# Altium project STM32F427IIH6.PrjPcb
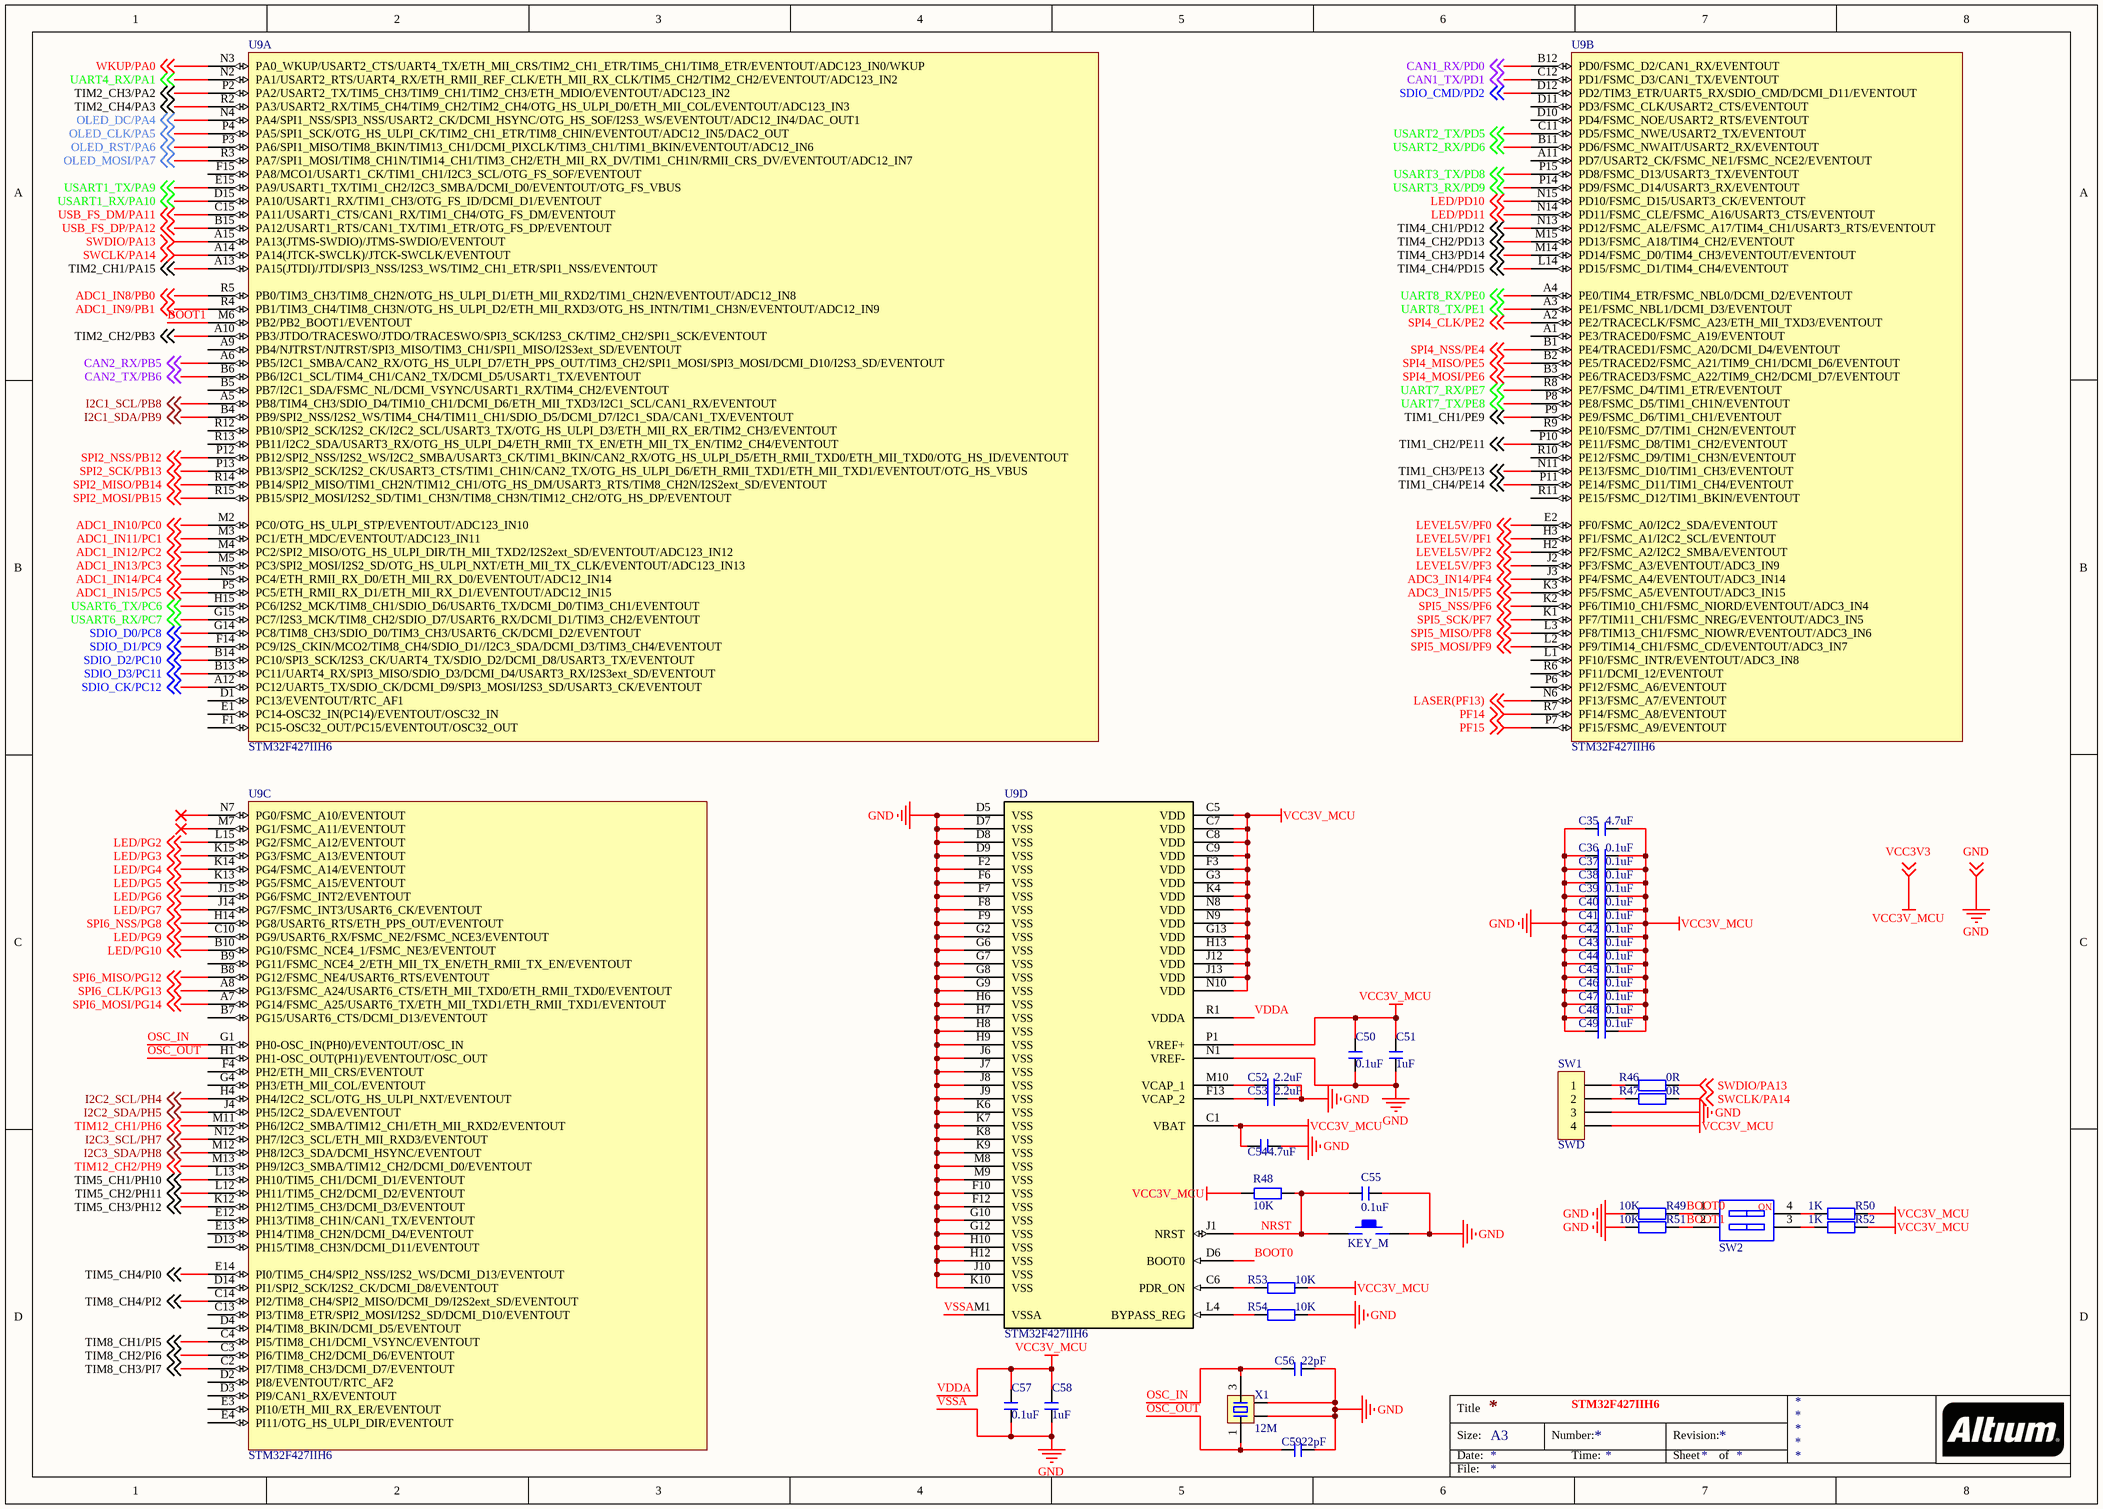
[diagram p0: STM32Core.SchDoc]
2 sheets, 130 parts. Net scope: global (net labels, ports and power ports of the same name join across sheets).
Board file: STM32F427IIH6.PcbDoc
Sheets:
  STM32Core.SchDoc
  Peripheral.SchDoc

## Sheet STM32Core.SchDoc
size A3

### Parts
C35  4.7uF  [C 0402_L]
C36  0.1uF  [C 0402_L]
C37  0.1uF  [C 0402_L]
C38  0.1uF  [C 0402_L]
C39  0.1uF  [C 0402_L]
C40  0.1uF  [C 0402_L]
C41  0.1uF  [C 0402_L]
C42  0.1uF  [C 0402_L]
C43  0.1uF  [C 0402_L]
C44  0.1uF  [C 0402_L]
C45  0.1uF  [C 0402_L]
C46  0.1uF  [C 0402_L]
C47  0.1uF  [C 0402_L]
C48  0.1uF  [C 0402_L]
C49  0.1uF  [C 0402_L]
C50  0.1uF  [C 0402_L]
C51  1uF  [C 0402_L]
C52  2.2uF  [C 0402_L]
C53  2.2uF  [C 0402_L]
C54  4.7uF  [C 0402_L]
C55  0.1uF  [C 0402_L]
C56  22pF  [C 0402_L]
C57  0.1uF  [C 0402_L]
C58  1uF  [C 0402_L]
C59  22pF  [C 0402_L]
R46  0R  [R 0402_L]
R47  0R  [R 0402_L]
R48  10K  [R 0402_L]
R49  10K  [R 0402_L]
R50  1K  [R 0402_L]
R51  10K  [R 0402_L]
R52  1K  [R 0402_L]
R53  10K  [R 0402_L]
R54  10K  [R 0402_L]
RST2  KEY_M  [SMD-3.2*4.2]
SW1  SWD  [MX 1.25-WS-4P]
SW2  SW-2P  [CSW1.27 SMD-2P]  (value not drawn)
U9  STM32F427IIH6  [BGA 176]  (parts A,B,C,D of 4)
X1  12M  [OSC 3225-4P]

### Nets
VDDA: C35.2 C36.2 C37.2 C38.2 C39.2 C40.2 C41.2 C42.2 C43.2 C44.2 C45.2 C46.2 C47.2 C48.2 C49.2 C50.2 C51.2 C54.2 C57.2 C58.2 R48.2 R50.2 R52.2 R53.1 SW1.4 U9.C1(VBAT) U9.C5(VDD) U9.C7(VDD) U9.C8(VDD) U9.C9(VDD) U9.F3(VDD) U9.G3(VDD) U9.G13(VDD) U9.H13(VDD) U9.J12(VDD) U9.J13(VDD) U9.K4(VDD) U9.N8(VDD) U9.N9(VDD) U9.N10(VDD) U9.P1(VREF+) U9.R1(VDDA) ; off-sheet VCC3V3  [also labelled VCC3V3, VCC3V_MCU]
VSSA: C35.1 C36.1 C37.1 C38.1 C39.1 C40.1 C41.1 C42.1 C43.1 C44.1 C45.1 C46.1 C47.1 C48.1 C49.1 C50.1 C51.1 C52.2 C53.2 C54.1 C55.2 C56.2 C57.1 C58.1 C59.2 R49.1 R51.1 R54.1 RST2.2 SW1.3 U9.D5(VSS) U9.D7(VSS) U9.D8(VSS) U9.D9(VSS) U9.F2(VSS) U9.F6(VSS) U9.F7(VSS) U9.F8(VSS) U9.F9(VSS) U9.F10(VSS) U9.F12(VSS) U9.G2(VSS) U9.G6(VSS) U9.G7(VSS) U9.G8(VSS) U9.G9(VSS) U9.G10(VSS) U9.G12(VSS) U9.H6(VSS) U9.H7(VSS) U9.H8(VSS) U9.H9(VSS) U9.H10(VSS) U9.H12(VSS) U9.J6(VSS) U9.J7(VSS) U9.J8(VSS) U9.J9(VSS) U9.J10(VSS) U9.K6(VSS) U9.K7(VSS) U9.K8(VSS) U9.K9(VSS) U9.K10(VSS) U9.M1(VSSA) U9.M8(VSS) U9.M9(VSS) U9.N1(VREF-) X1.2 X1.4 ; off-sheet GND  [also labelled GND]
ADC1_IN8/PB0: U9.R5(PB0/TIM3_CH3/TIM8_CH2N/OTG_HS_ULPI_D1/ETH_MII_RXD2/TIM1_CH2N/EVENTOUT/ADC12_IN8) ; off-sheet ADC1_IN8/PB0
ADC1_IN9/PB1: U9.R4(PB1/TIM3_CH4/TIM8_CH3N/OTG_HS_ULPI_D2/ETH_MII_RXD3/OTG_HS_INTN/TIM1_CH3N/EVENTOUT/ADC12_IN9) ; off-sheet ADC1_IN9/PB1
ADC1_IN10/PC0: U9.M2(PC0/OTG_HS_ULPI_STP/EVENTOUT/ADC123_IN10) ; off-sheet ADC1_IN10/PC0
ADC1_IN11/PC1: U9.M3(PC1/ETH_MDC/EVENTOUT/ADC123_IN11) ; off-sheet ADC1_IN11/PC1
ADC1_IN12/PC2: U9.M4(PC2/SPI2_MISO/OTG_HS_ULPI_DIR/TH_MII_TXD2/I2S2ext_SD/EVENTOUT/ADC123_IN12) ; off-sheet ADC1_IN12/PC2
ADC1_IN13/PC3: U9.M5(PC3/SPI2_MOSI/I2S2_SD/OTG_HS_ULPI_NXT/ETH_MII_TX_CLK/EVENTOUT/ADC123_IN13) ; off-sheet ADC1_IN13/PC3
ADC1_IN14/PC4: U9.N5(PC4/ETH_RMII_RX_D0/ETH_MII_RX_D0/EVENTOUT/ADC12_IN14) ; off-sheet ADC1_IN14/PC4
ADC1_IN15/PC5: U9.P5(PC5/ETH_RMII_RX_D1/ETH_MII_RX_D1/EVENTOUT/ADC12_IN15) ; off-sheet ADC1_IN15/PC5
ADC3_IN14/PF4: U9.J3(PF4/FSMC_A4/EVENTOUT/ADC3_IN14) ; off-sheet ADC3_IN14/PF4
ADC3_IN15/PF5: U9.K3(PF5/FSMC_A5/EVENTOUT/ADC3_IN15) ; off-sheet ADC3_IN15/PF5
BOOT0: R49.2 SW2.1 U9.D6(BOOT0)
BOOT1: R51.2 SW2.2 U9.M6(PB2/PB2_BOOT1/EVENTOUT)
CAN1_RX/PD0: U9.B12(PD0/FSMC_D2/CAN1_RX/EVENTOUT) ; off-sheet CAN1_RX/PD0
CAN1_TX/PD1: U9.C12(PD1/FSMC_D3/CAN1_TX/EVENTOUT) ; off-sheet CAN1_TX/PD1
CAN2_RX/PB5: U9.A6(PB5/I2C1_SMBA/CAN2_RX/OTG_HS_ULPI_D7/ETH_PPS_OUT/TIM3_CH2/SPI1_MOSI/SPI3_MOSI/DCMI_D10/I2S3_SD/EVENTOUT) ; off-sheet CAN2_RX/PB5
CAN2_TX/PB6: U9.B6(PB6/I2C1_SCL/TIM4_CH1/CAN2_TX/DCMI_D5/USART1_TX/EVENTOUT) ; off-sheet CAN2_TX/PB6
I2C1_SCL/PB8: U9.A5(PB8/TIM4_CH3/SDIO_D4/TIM10_CH1/DCMI_D6/ETH_MII_TXD3/I2C1_SCL/CAN1_RX/EVENTOUT) ; off-sheet I2C1_SCL/PB8
I2C1_SDA/PB9: U9.B4(PB9/SPI2_NSS/I2S2_WS/TIM4_CH4/TIM11_CH1/SDIO_D5/DCMI_D7/I2C1_SDA/CAN1_TX/EVENTOUT) ; off-sheet I2C1_SDA/PB9
I2C2_SCL/PH4: U9.H4(PH4/I2C2_SCL/OTG_HS_ULPI_NXT/EVENTOUT) ; off-sheet I2C2_SCL/PH4
I2C2_SDA/PH5: U9.J4(PH5/I2C2_SDA/EVENTOUT) ; off-sheet I2C2_SDA/PH5
I2C3_SCL/PH7: U9.N12(PH7/I2C3_SCL/ETH_MII_RXD3/EVENTOUT) ; off-sheet I2C3_SCL/PH7
I2C3_SDA/PH8: U9.M12(PH8/I2C3_SDA/DCMI_HSYNC/EVENTOUT) ; off-sheet I2C3_SDA/PH8
LASER(PF13): U9.N6(PF13/FSMC_A7/EVENTOUT) ; off-sheet LASER(PF13)
LED/PD10: U9.N15(PD10/FSMC_D15/USART3_CK/EVENTOUT) ; off-sheet LED/PD10
LED/PD11: U9.N14(PD11/FSMC_CLE/FSMC_A16/USART3_CTS/EVENTOUT) ; off-sheet LED/PD11
LED/PG2: U9.L15(PG2/FSMC_A12/EVENTOUT) ; off-sheet LED/PG2
LED/PG3: U9.K15(PG3/FSMC_A13/EVENTOUT) ; off-sheet LED/PG3
LED/PG4: U9.K14(PG4/FSMC_A14/EVENTOUT) ; off-sheet LED/PG4
LED/PG5: U9.K13(PG5/FSMC_A15/EVENTOUT) ; off-sheet LED/PG5
LED/PG6: U9.J15(PG6/FSMC_INT2/EVENTOUT) ; off-sheet LED/PG6
LED/PG7: U9.J14(PG7/FSMC_INT3/USART6_CK/EVENTOUT) ; off-sheet LED/PG7
LED/PG9: U9.C10(PG9/USART6_RX/FSMC_NE2/FSMC_NCE3/EVENTOUT) ; off-sheet LED/PG9
LED/PG10: U9.B10(PG10/FSMC_NCE4_1/FSMC_NE3/EVENTOUT) ; off-sheet LED/PG10
LEVEL5V/PF0: U9.E2(PF0/FSMC_A0/I2C2_SDA/EVENTOUT) ; off-sheet LEVEL5V/PF0
LEVEL5V/PF1: U9.H3(PF1/FSMC_A1/I2C2_SCL/EVENTOUT) ; off-sheet LEVEL5V/PF1
LEVEL5V/PF2: U9.H2(PF2/FSMC_A2/I2C2_SMBA/EVENTOUT) ; off-sheet LEVEL5V/PF2
LEVEL5V/PF3: U9.J2(PF3/FSMC_A3/EVENTOUT/ADC3_IN9) ; off-sheet LEVEL5V/PF3
NRST: C55.1 R48.1 RST2.1 U9.J1(NRST)
OLED_CLK/PA5: U9.P4(PA5/SPI1_SCK/OTG_HS_ULPI_CK/TIM2_CH1_ETR/TIM8_CHIN/EVENTOUT/ADC12_IN5/DAC2_OUT) ; off-sheet OLED_CLK/PA5
OLED_DC/PA4: U9.N4(PA4/SPI1_NSS/SPI3_NSS/USART2_CK/DCMI_HSYNC/OTG_HS_SOF/I2S3_WS/EVENTOUT/ADC12_IN4/DAC_OUT1) ; off-sheet OLED_DC/PA4
OLED_MOSI/PA7: U9.R3(PA7/SPI1_MOSI/TIM8_CH1N/TIM14_CH1/TIM3_CH2/ETH_MII_RX_DV/TIM1_CH1N/RMII_CRS_DV/EVENTOUT/ADC12_IN7) ; off-sheet OLED_MOSI/PA7
OLED_RST/PA6: U9.P3(PA6/SPI1_MISO/TIM8_BKIN/TIM13_CH1/DCMI_PIXCLK/TIM3_CH1/TIM1_BKIN/EVENTOUT/ADC12_IN6) ; off-sheet OLED_RST/PA6
OSC_IN: C56.1 U9.G1(PH0-OSC_IN(PH0)/EVENTOUT/OSC_IN) X1.3
OSC_OUT: C59.1 U9.H1(PH1-OSC_OUT(PH1)/EVENTOUT/OSC_OUT) X1.1
PF14: U9.R7(PF14/FSMC_A8/EVENTOUT) ; off-sheet PF14
PF15: U9.P7(PF15/FSMC_A9/EVENTOUT) ; off-sheet PF15
SDIO_CK/PC12: U9.A12(PC12/UART5_TX/SDIO_CK/DCMI_D9/SPI3_MOSI/I2S3_SD/USART3_CK/EVENTOUT) ; off-sheet SDIO_CK/PC12  [project net SDIO_CLK(PC12)]
SDIO_CMD/PD2: U9.D12(PD2/TIM3_ETR/UART5_RX/SDIO_CMD/DCMI_D11/EVENTOUT) ; off-sheet SDIO_CMD/PD2  [project net SDIO_CMD(PD2)]
SDIO_D0/PC8: U9.G14(PC8/TIM8_CH3/SDIO_D0/TIM3_CH3/USART6_CK/DCMI_D2/EVENTOUT) ; off-sheet SDIO_D0/PC8  [project net SDIO_D0(PC8)]
SDIO_D1/PC9: U9.F14(PC9/I2S_CKIN/MCO2/TIM8_CH4/SDIO_D1//I2C3_SDA/DCMI_D3/TIM3_CH4/EVENTOUT) ; off-sheet SDIO_D1/PC9  [project net SDIO_D1(PC9)]
SDIO_D2/PC10: U9.B14(PC10/SPI3_SCK/I2S3_CK/UART4_TX/SDIO_D2/DCMI_D8/USART3_TX/EVENTOUT) ; off-sheet SDIO_D2/PC10  [project net SDIO_D2(PC10)]
SDIO_D3/PC11: U9.B13(PC11/UART4_RX/SPI3_MISO/SDIO_D3/DCMI_D4/USART3_RX/I2S3ext_SD/EVENTOUT) ; off-sheet SDIO_D3/PC11  [project net SDIO_D3(PC11)]
SPI2_MISO/PB14: U9.R14(PB14/SPI2_MISO/TIM1_CH2N/TIM12_CH1/OTG_HS_DM/USART3_RTS/TIM8_CH2N/I2S2ext_SD/EVENTOUT) ; off-sheet SPI2_MISO/PB14
SPI2_MOSI/PB15: U9.R15(PB15/SPI2_MOSI/I2S2_SD/TIM1_CH3N/TIM8_CH3N/TIM12_CH2/OTG_HS_DP/EVENTOUT) ; off-sheet SPI2_MOSI/PB15
SPI2_NSS/PB12: U9.P12(PB12/SPI2_NSS/I2S2_WS/I2C2_SMBA/USART3_CK/TIM1_BKIN/CAN2_RX/OTG_HS_ULPI_D5/ETH_RMII_TXD0/ETH_MII_TXD0/OTG_HS_ID/EVENTOUT) ; off-sheet SPI2_NSS/PB12
SPI2_SCK/PB13: U9.P13(PB13/SPI2_SCK/I2S2_CK/USART3_CTS/TIM1_CH1N/CAN2_TX/OTG_HS_ULPI_D6/ETH_RMII_TXD1/ETH_MII_TXD1/EVENTOUT/OTG_HS_VBUS) ; off-sheet SPI2_SCK/PB13
SPI4_CLK/PE2: U9.A2(PE2/TRACECLK/FSMC_A23/ETH_MII_TXD3/EVENTOUT) ; off-sheet SPI4_CLK/PE2
SPI4_MISO/PE5: U9.B2(PE5/TRACED2/FSMC_A21/TIM9_CH1/DCMI_D6/EVENTOUT) ; off-sheet SPI4_MISO/PE5
SPI4_MOSI/PE6: U9.B3(PE6/TRACED3/FSMC_A22/TIM9_CH2/DCMI_D7/EVENTOUT) ; off-sheet SPI4_MOSI/PE6
SPI4_NSS/PE4: U9.B1(PE4/TRACED1/FSMC_A20/DCMI_D4/EVENTOUT) ; off-sheet SPI4_NSS/PE4
SPI5_MISO/PF8: U9.L3(PF8/TIM13_CH1/FSMC_NIOWR/EVENTOUT/ADC3_IN6) ; off-sheet SPI5_MISO/PF8
SPI5_MOSI/PF9: U9.L2(PF9/TIM14_CH1/FSMC_CD/EVENTOUT/ADC3_IN7) ; off-sheet SPI5_MOSI/PF9
SPI5_NSS/PF6: U9.K2(PF6/TIM10_CH1/FSMC_NIORD/EVENTOUT/ADC3_IN4) ; off-sheet SPI5_NSS/PF6
SPI5_SCK/PF7: U9.K1(PF7/TIM11_CH1/FSMC_NREG/EVENTOUT/ADC3_IN5) ; off-sheet SPI5_SCK/PF7
SPI6_CLK/PG13: U9.A8(PG13/FSMC_A24/USART6_CTS/ETH_MII_TXD0/ETH_RMII_TXD0/EVENTOUT) ; off-sheet SPI6_CLK/PG13
SPI6_MISO/PG12: U9.B8(PG12/FSMC_NE4/USART6_RTS/EVENTOUT) ; off-sheet SPI6_MISO/PG12
SPI6_MOSI/PG14: U9.A7(PG14/FSMC_A25/USART6_TX/ETH_MII_TXD1/ETH_RMII_TXD1/EVENTOUT) ; off-sheet SPI6_MOSI/PG14
SPI6_NSS/PG8: U9.H14(PG8/USART6_RTS/ETH_PPS_OUT/EVENTOUT) ; off-sheet SPI6_NSS/PG8
SWCLK/PA14: R47.2 U9.A14(PA14(JTCK-SWCLK)/JTCK-SWCLK/EVENTOUT) ; off-sheet SWCLK/PA14
SWDIO/PA13: R46.2 U9.A15(PA13(JTMS-SWDIO)/JTMS-SWDIO/EVENTOUT) ; off-sheet SWDIO/PA13
TIM1_CH1/PE9: U9.P9(PE9/FSMC_D6/TIM1_CH1/EVENTOUT) ; off-sheet TIM1_CH1/PE9
TIM1_CH2/PE11: U9.P10(PE11/FSMC_D8/TIM1_CH2/EVENTOUT) ; off-sheet TIM1_CH2/PE11
TIM1_CH3/PE13: U9.N11(PE13/FSMC_D10/TIM1_CH3/EVENTOUT) ; off-sheet TIM1_CH3/PE13
TIM1_CH4/PE14: U9.P11(PE14/FSMC_D11/TIM1_CH4/EVENTOUT) ; off-sheet TIM1_CH4/PE14
TIM2_CH1/PA15: U9.A13(PA15(JTDI)/JTDI/SPI3_NSS/I2S3_WS/TIM2_CH1_ETR/SPI1_NSS/EVENTOUT) ; off-sheet TIM2_CH1/PA15
TIM2_CH2/PB3: U9.A10(PB3/JTDO/TRACESWO/JTDO/TRACESWO/SPI3_SCK/I2S3_CK/TIM2_CH2/SPI1_SCK/EVENTOUT) ; off-sheet TIM2_CH2/PB3
TIM2_CH3/PA2: U9.P2(PA2/USART2_TX/TIM5_CH3/TIM9_CH1/TIM2_CH3/ETH_MDIO/EVENTOUT/ADC123_IN2) ; off-sheet TIM2_CH3/PA2
TIM2_CH4/PA3: U9.R2(PA3/USART2_RX/TIM5_CH4/TIM9_CH2/TIM2_CH4/OTG_HS_ULPI_D0/ETH_MII_COL/EVENTOUT/ADC123_IN3) ; off-sheet TIM2_CH4/PA3
TIM4_CH1/PD12: U9.N13(PD12/FSMC_ALE/FSMC_A17/TIM4_CH1/USART3_RTS/EVENTOUT) ; off-sheet TIM4_CH1/PD12
TIM4_CH2/PD13: U9.M15(PD13/FSMC_A18/TIM4_CH2/EVENTOUT) ; off-sheet TIM4_CH2/PD13
TIM4_CH3/PD14: U9.M14(PD14/FSMC_D0/TIM4_CH3/EVENTOUT/EVENTOUT) ; off-sheet TIM4_CH3/PD14
TIM4_CH4/PD15: U9.L14(PD15/FSMC_D1/TIM4_CH4/EVENTOUT) ; off-sheet TIM4_CH4/PD15
TIM5_CH1/PH10: U9.L13(PH10/TIM5_CH1/DCMI_D1/EVENTOUT) ; off-sheet TIM5_CH1/PH10
TIM5_CH2/PH11: U9.L12(PH11/TIM5_CH2/DCMI_D2/EVENTOUT) ; off-sheet TIM5_CH2/PH11
TIM5_CH3/PH12: U9.K12(PH12/TIM5_CH3/DCMI_D3/EVENTOUT) ; off-sheet TIM5_CH3/PH12
TIM5_CH4/PI0: U9.E14(PI0/TIM5_CH4/SPI2_NSS/I2S2_WS/DCMI_D13/EVENTOUT) ; off-sheet TIM5_CH4/PI0
TIM8_CH1/PI5: U9.C4(PI5/TIM8_CH1/DCMI_VSYNC/EVENTOUT) ; off-sheet TIM8_CH1/PI5
TIM8_CH2/PI6: U9.C3(PI6/TIM8_CH2/DCMI_D6/EVENTOUT) ; off-sheet TIM8_CH2/PI6
TIM8_CH3/PI7: U9.C2(PI7/TIM8_CH3/DCMI_D7/EVENTOUT) ; off-sheet TIM8_CH3/PI7
TIM8_CH4/PI2: U9.C14(PI2/TIM8_CH4/SPI2_MISO/DCMI_D9/I2S2ext_SD/EVENTOUT) ; off-sheet TIM8_CH4/PI2
TIM12_CH1/PH6: U9.M11(PH6/I2C2_SMBA/TIM12_CH1/ETH_MII_RXD2/EVENTOUT) ; off-sheet TIM12_CH1/PH6
TIM12_CH2/PH9: U9.M13(PH9/I2C3_SMBA/TIM12_CH2/DCMI_D0/EVENTOUT) ; off-sheet TIM12_CH2/PH9
UART4_RX/PA1: U9.N2(PA1/USART2_RTS/UART4_RX/ETH_RMII_REF_CLK/ETH_MII_RX_CLK/TIM5_CH2/TIM2_CH2/EVENTOUT/ADC123_IN2) ; off-sheet UART4_RX/PA1
UART7_RX/PE7: U9.R8(PE7/FSMC_D4/TIM1_ETR/EVENTOUT) ; off-sheet UART7_RX/PE7
UART7_TX/PE8: U9.P8(PE8/FSMC_D5/TIM1_CH1N/EVENTOUT) ; off-sheet UART7_TX/PE8
UART8_RX/PE0: U9.A4(PE0/TIM4_ETR/FSMC_NBL0/DCMI_D2/EVENTOUT) ; off-sheet UART8_RX/PE0
UART8_TX/PE1: U9.A3(PE1/FSMC_NBL1/DCMI_D3/EVENTOUT) ; off-sheet UART8_TX/PE1
USART1_RX/PA10: U9.D15(PA10/USART1_RX/TIM1_CH3/OTG_FS_ID/DCMI_D1/EVENTOUT) ; off-sheet USART1_RX/PA10
USART1_TX/PA9: U9.E15(PA9/USART1_TX/TIM1_CH2/I2C3_SMBA/DCMI_D0/EVENTOUT/OTG_FS_VBUS) ; off-sheet USART1_TX/PA9
USART2_RX/PD6: U9.B11(PD6/FSMC_NWAIT/USART2_RX/EVENTOUT) ; off-sheet USART2_RX/PD6
USART2_TX/PD5: U9.C11(PD5/FSMC_NWE/USART2_TX/EVENTOUT) ; off-sheet USART2_TX/PD5
USART3_RX/PD9: U9.P14(PD9/FSMC_D14/USART3_RX/EVENTOUT) ; off-sheet USART3_RX/PD9
USART3_TX/PD8: U9.P15(PD8/FSMC_D13/USART3_TX/EVENTOUT) ; off-sheet USART3_TX/PD8
USART6_RX/PC7: U9.G15(PC7/I2S3_MCK/TIM8_CH2/SDIO_D7/USART6_RX/DCMI_D1/TIM3_CH2/EVENTOUT) ; off-sheet USART6_RX/PC7
USART6_TX/PC6: U9.H15(PC6/I2S2_MCK/TIM8_CH1/SDIO_D6/USART6_TX/DCMI_D0/TIM3_CH1/EVENTOUT) ; off-sheet USART6_TX/PC6
USB_FS_DM/PA11: U9.C15(PA11/USART1_CTS/CAN1_RX/TIM1_CH4/OTG_FS_DM/EVENTOUT) ; off-sheet USB_FS_DM/PA11
USB_FS_DP/PA12: U9.B15(PA12/USART1_RTS/CAN1_TX/TIM1_ETR/OTG_FS_DP/EVENTOUT) ; off-sheet USB_FS_DP/PA12
WKUP/PA0: U9.N3(PA0_WKUP/USART2_CTS/UART4_TX/ETH_MII_CRS/TIM2_CH1_ETR/TIM5_CH1/TIM8_ETR/EVENTOUT/ADC123_IN0/WKUP) ; off-sheet WKUP/PA0
NetC52_1: C52.1 U9.M10(VCAP_1)
NetC53_1: C53.1 U9.F13(VCAP_2)
NetR46_1: R46.1 SW1.1
NetR47_1: R47.1 SW1.2
NetR50_1: R50.1 SW2.4
NetR52_1: R52.1 SW2.3
NetR53_2: R53.2 U9.C6(PDR_ON)
NetR54_2: R54.2 U9.L4(BYPASS_REG)

Not connected (* = marked no-connect by the designer): U9 A1(PE3/TRACED0/FSMC_A19/EVENTOUT) A9(PB4/NJTRST/NJTRST/SPI3_MISO/TIM3_CH1/SPI1_MISO/I2S3ext_SD/EVENTOUT) A11(PD7/USART2_CK/FSMC_NE1/FSMC_NCE2/EVENTOUT) B5(PB7/I2C1_SDA/FSMC_NL/DCMI_VSYNC/USART1_RX/TIM4_CH2/EVENTOUT) B7(PG15/USART6_CTS/DCMI_D13/EVENTOUT) B9(PG11/FSMC_NCE4_2/ETH_MII_TX_EN/ETH_RMII_TX_EN/EVENTOUT) C13(PI3/TIM8_ETR/SPI2_MOSI/I2S2_SD/DCMI_D10/EVENTOUT) D1(PC13/EVENTOUT/RTC_AF1) D2(PI8/EVENTOUT/RTC_AF2) D3(PI9/CAN1_RX/EVENTOUT) D4(PI4/TIM8_BKIN/DCMI_D5/EVENTOUT) D10(PD4/FSMC_NOE/USART2_RTS/EVENTOUT) D11(PD3/FSMC_CLK/USART2_CTS/EVENTOUT) D13(PH15/TIM8_CH3N/DCMI_D11/EVENTOUT) D14(PI1/SPI2_SCK/I2S2_CK/DCMI_D8/EVENTOUT) E1(PC14-OSC32_IN(PC14)/EVENTOUT/OSC32_IN) E3(PI10/ETH_MII_RX_ER/EVENTOUT) E4(PI11/OTG_HS_ULPI_DIR/EVENTOUT) E12(PH13/TIM8_CH1N/CAN1_TX/EVENTOUT) E13(PH14/TIM8_CH2N/DCMI_D4/EVENTOUT) F1(PC15-OSC32_OUT/PC15/EVENTOUT/OSC32_OUT) F4(PH2/ETH_MII_CRS/EVENTOUT) F15(PA8/MCO1/USART1_CK/TIM1_CH1/I2C3_SCL/OTG_FS_SOF/EVENTOUT) G4(PH3/ETH_MII_COL/EVENTOUT) L1(PF10/FSMC_INTR/EVENTOUT/ADC3_IN8) M7(PG1/FSMC_A11/EVENTOUT)* N7(PG0/FSMC_A10/EVENTOUT)* P6(PF12/FSMC_A6/EVENTOUT) R6(PF11/DCMI_12/EVENTOUT) R9(PE10/FSMC_D7/TIM1_CH2N/EVENTOUT) R10(PE12/FSMC_D9/TIM1_CH3N/EVENTOUT) R11(PE15/FSMC_D12/TIM1_BKIN/EVENTOUT) R12(PB10/SPI2_SCK/I2S2_CK/I2C2_SCL/USART3_TX/OTG_HS_ULPI_D3/ETH_MII_RX_ER/TIM2_CH3/EVENTOUT) R13(PB11/I2C2_SDA/USART3_RX/OTG_HS_ULPI_D4/ETH_RMII_TX_EN/ETH_MII_TX_EN/TIM2_CH4/EVENTOUT)

### Notes on the sheet
- STM32F427IIH6
- Title
- Size:
- Date:
- A3
- Number:
- Time:
- Revision:
- Sheet
- of
- File:
- (in symbol SW-2P) NO

### Library data of the parts
C35-C59 = C: 贴片电容
R46-R54 = R: 贴片电阻
SW1 = HDR1x4: Connector
SW2 = SW-2P: 2路编码开关
U9 = STM32F427IIH6_MX: No Description Available; Vendor: STMicroelectronics; Built_By: EMA_UL_Team; SourceLibrary: Updates_to_database_2020-10-19; Manufacturer_Part_Number: STM32F427IIH6; Copyright: Copyright (C) 2018 Accelerated Designs. All rights reserved; RefDes: RefDes; Type: DEV
X1 = XTAL-4P: 4脚无源晶振

## Sheet Peripheral.SchDoc
size A3
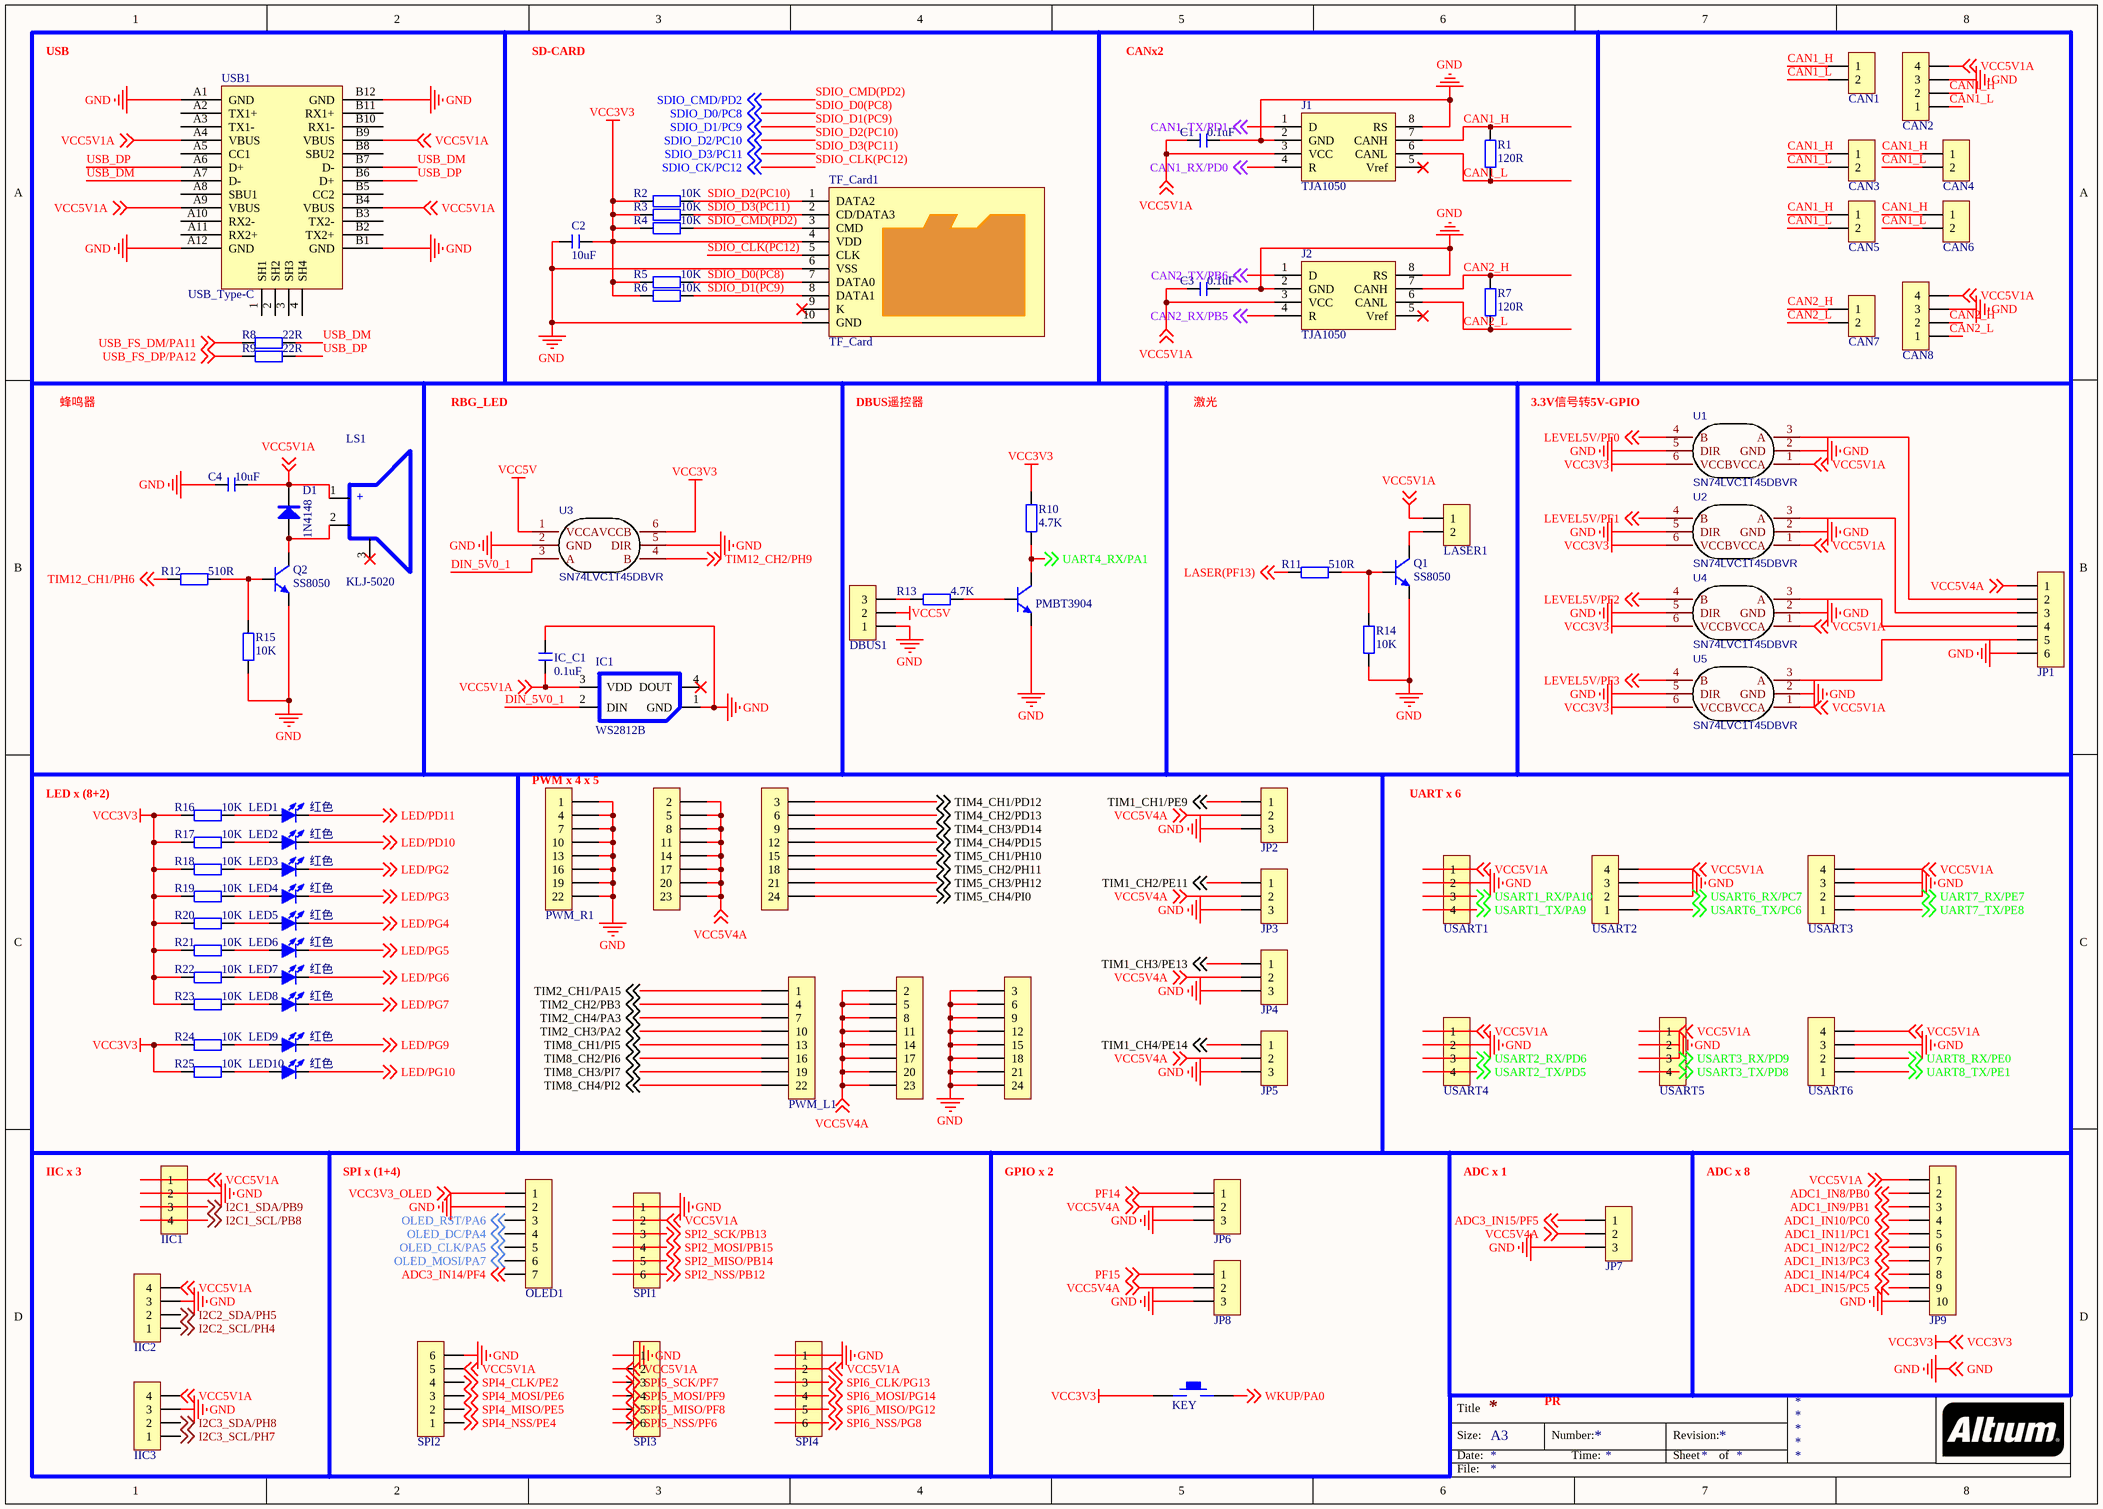
[diagram p1: Peripheral.SchDoc]

### Parts
C1  0.1uF  [C 0402_L]
C2  10uF  [C 0402_L]
C3  0.1uF  [C 0402_L]
C4  10uF  [C 0402_L]
CAN1  HDR-1X2  [MX 1.25-LS-2P]  (value not drawn)
CAN2  HDR-1X4  [MX 1.25-WS-4P]  (value not drawn)
CAN3  HDR-1X2  [MX 1.25-LS-2P]  (value not drawn)
CAN4  HDR-1X2  [MX 1.25-LS-2P]  (value not drawn)
CAN5  HDR-1X2  [MX 1.25-LS-2P]  (value not drawn)
CAN6  HDR-1X2  [MX 1.25-LS-2P]  (value not drawn)
CAN7  HDR-1X2  [MX 1.25-LS-2P]  (value not drawn)
CAN8  HDR-1X4  [MX 1.25-LS-4P]  (value not drawn)
D1  1N4148  [SOD-323]
DBUS1  HDR-1X3  [HDR2.54-WS-3P]  (value not drawn)
IC1  WS2812B  [LED 3528-4Pin]
IC_C1  0.1uF  [C 0402_L]
IIC1  HDR-1X4  [MX 1.25-WS-4P]  (value not drawn)
IIC2  HDR-1X4  [MX 1.25-LS-4P]  (value not drawn)
IIC3  HDR-1X4  [MX 1.25-LS-4P]  (value not drawn)
J1  TJA1050  [SOIC-8_150mil]
J2  TJA1050  [SOIC-8_150mil]
JP1  HDR-1X6  [MX 1.25-LS-6P]  (value not drawn)
JP2  HDR-1X3  [HDR2.54-LI-3P]  (value not drawn)
JP3  HDR-1X3  [HDR2.54-LI-3P]  (value not drawn)
JP4  HDR-1X3  [HDR2.54-LI-3P]  (value not drawn)
JP5  HDR-1X3  [HDR2.54-LI-3P]  (value not drawn)
JP6  HDR-1X3  [HDR2.54-LI-3P]  (value not drawn)
JP7  HDR-1X3  [MX 1.25-WS-3P]  (value not drawn)
JP8  HDR-1X3  [HDR2.54-LI-3P]  (value not drawn)
JP9  HDR-1X10  [MX 1.25-LS-10P]  (value not drawn)
LASER1  HDR-1X2  [MX 1.25-LS-2P]  (value not drawn)
LED1  红色  [LED 0805G]
LED2  红色  [LED 0805G]
LED3  红色  [LED 0805G]
LED4  红色  [LED 0805G]
LED5  红色  [LED 0805G]
LED6  红色  [LED 0805G]
LED7  红色  [LED 0805G]
LED8  红色  [LED 0805G]
LED9  红色  [LED 0805R]
LED10  红色  [LED 0805R]
LS1  KLJ-5020  [BUZ-SMD_4P-L5.0-W5.0-P3.80-TL]
OLED1  HDR-1X7  [MX 1.25-WS-7P]  (value not drawn)
PWM_L1  HDR3*8-left  [PIN-3*8-2.54 - duplicate]  (value not drawn)
PWM_R1  HDR3*8-right  [PIN-3*8-2.54 - duplicate]  (value not drawn)
Q1  SS8050  [SOT23-3L]
Q2  SS8050  [SOT23-3L]
Q3  PMBT3904  [SOT-23-3]
R1  120R  [R 0402_L]
R2  10K  [R 0402_L]
R3  10K  [R 0402_L]
R4  10K  [R 0402_L]
R5  10K  [R 0402_L]
R6  10K  [R 0402_L]
R7  120R  [R 0402_L]
R8  22R  [R 0402_L]
R9  22R  [R 0402_L]
R10  4.7K  [R 0402_L]
R11  510R  [R 0402_L]
R12  510R  [R 0402_L]
R13  4.7K  [R 0402_L]
R14  10K  [R 0402_L]
R15  10K  [R 0402_L]
R16  10K  [R 0402_L]
R17  10K  [R 0402_L]
R18  10K  [R 0402_L]
R19  10K  [R 0402_L]
R20  10K  [R 0402_L]
R21  10K  [R 0402_L]
R22  10K  [R 0402_L]
R23  10K  [R 0402_L]
R24  10K  [R 0402_L]
R25  10K  [R 0402_L]
RST1  KEY  [SMD-3.2*4.2]
SPI1  HDR-1X6  [MX 1.25-WS-6P]  (value not drawn)
SPI2  HDR-1X6  [MX 1.25-LS-6P]  (value not drawn)
SPI3  HDR-1X6  [MX 1.25-WS-6P]  (value not drawn)
SPI4  HDR-1X6  [MX 1.25-WS-6P]  (value not drawn)
TF_Card1  TF_Card  [Micro SD]
U1  SN74LVC1T45DBVR  [SOT-23-6_L2.9-W1.6-P0.95-LS2.8-BL]
U2  SN74LVC1T45DBVR  [SOT-23-6_L2.9-W1.6-P0.95-LS2.8-BL]
U3  SN74LVC1T45DBVR  [SOT-23-6_L2.9-W1.6-P0.95-LS2.8-BL]
U4  SN74LVC1T45DBVR  [SOT-23-6_L2.9-W1.6-P0.95-LS2.8-BL]
U5  SN74LVC1T45DBVR  [SOT-23-6_L2.9-W1.6-P0.95-LS2.8-BL]
USART1  HDR-1X4  [MX 1.25-LS-4P]  (value not drawn)
USART2  HDR-1X4  [MX 1.25-WS-4P]  (value not drawn)
USART3  HDR-1X4  [MX 1.25-WS-4P]  (value not drawn)
USART4  HDR-1X4  [MX 1.25-LS-4P]  (value not drawn)
USART5  HDR-1X4  [MX 1.25-LS-4P]  (value not drawn)
USART6  HDR-1X4  [MX 1.25-WS-4P]  (value not drawn)
USB1  USB_Type-C  [Type-C-TOP]

### Nets
GND: C1.1 C2.1 C3.1 C4.2 CAN2.3 CAN8.3 DBUS1.1 IC1.1(GND) IC_C1.1 IIC1.2 IIC2.3 IIC3.3 J1.2(GND) J1.8(RS) J2.2(GND) J2.8(RS) JP1.6 JP2.3 JP3.3 JP4.3 JP5.3 JP6.3 JP7.3 JP8.3 JP9.10 OLED1.2 PWM_L1.3 PWM_L1.6 PWM_L1.9 PWM_L1.12 PWM_L1.15 PWM_L1.18 PWM_L1.21 PWM_L1.24 PWM_R1.1 PWM_R1.4 PWM_R1.7 PWM_R1.10 PWM_R1.13 PWM_R1.16 PWM_R1.19 PWM_R1.22 Q1.2(E) Q2.2(E) Q3.2(E) R14.1 R15.1 SPI1.1 SPI2.6 SPI3.1 SPI4.1 TF_Card1.6(VSS) TF_Card1.10(GND) U1.2(GND) U1.5(DIR) U2.2(GND) U2.5(DIR) U3.2(GND) U3.5(DIR) U4.2(GND) U4.5(DIR) U5.2(GND) U5.5(DIR) USART1.2 USART2.3 USART3.3 USART4.2 USART5.2 USART6.3 USB1.A1(GND) USB1.A12(GND) USB1.B1(GND) USB1.B12(GND) ; off-sheet GND  [project net VSSA]
VCC3V3: C2.2 R2.1 R3.1 R4.1 R5.1 R6.1 R10.2 R16.1 R17.1 R18.1 R19.1 R20.1 R21.1 R22.1 R23.1 R24.1 R25.1 RST1.1 TF_Card1.4(VDD) U1.6(VCCB) U2.6(VCCB) U3.6(VCCB) U4.6(VCCB) U5.6(VCCB) ; off-sheet VCC3V3  [project net VDDA]
VCC5V: DBUS1.2 U3.1(VCCA)
ADC1_IN8/PB0: JP9.2 ; off-sheet ADC1_IN8/PB0
ADC1_IN9/PB1: JP9.3 ; off-sheet ADC1_IN9/PB1
ADC1_IN10/PC0: JP9.4 ; off-sheet ADC1_IN10/PC0
ADC1_IN11/PC1: JP9.5 ; off-sheet ADC1_IN11/PC1
ADC1_IN12/PC2: JP9.6 ; off-sheet ADC1_IN12/PC2
ADC1_IN13/PC3: JP9.7 ; off-sheet ADC1_IN13/PC3
ADC1_IN14/PC4: JP9.8 ; off-sheet ADC1_IN14/PC4
ADC1_IN15/PC5: JP9.9 ; off-sheet ADC1_IN15/PC5
ADC3_IN14/PF4: OLED1.7 ; off-sheet ADC3_IN14/PF4
ADC3_IN15/PF5: JP7.1 ; off-sheet ADC3_IN15/PF5
CAN1_H: CAN1.1 CAN2.2 CAN3.1 CAN4.1 CAN5.1 CAN6.1 J1.7(CANH) R1.2
CAN1_L: CAN1.2 CAN2.1 CAN3.2 CAN4.2 CAN5.2 CAN6.2 J1.6(CANL) R1.1
CAN1_RX/PD0: J1.4(R) ; off-sheet CAN1_RX/PD0
CAN1_TX/PD1: J1.1(D) ; off-sheet CAN1_TX/PD1
CAN2_H: CAN7.1 CAN8.2 J2.7(CANH) R7.2
CAN2_L: CAN7.2 CAN8.1 J2.6(CANL) R7.1
CAN2_RX/PB5: J2.4(R) ; off-sheet CAN2_RX/PB5
CAN2_TX/PB6: J2.1(D) ; off-sheet CAN2_TX/PB6
DIN_5V0_1: IC1.2(DIN) U3.3(A)
I2C1_SCL/PB8: IIC1.4 ; off-sheet I2C1_SCL/PB8
I2C1_SDA/PB9: IIC1.3 ; off-sheet I2C1_SDA/PB9
I2C2_SCL/PH4: IIC2.1 ; off-sheet I2C2_SCL/PH4
I2C2_SDA/PH5: IIC2.2 ; off-sheet I2C2_SDA/PH5
I2C3_SCL/PH7: IIC3.1 ; off-sheet I2C3_SCL/PH7
I2C3_SDA/PH8: IIC3.2 ; off-sheet I2C3_SDA/PH8
LASER(PF13): R11.1 ; off-sheet LASER(PF13)
LED/PD10: LED2.2(K) ; off-sheet LED/PD10
LED/PD11: LED1.2(K) ; off-sheet LED/PD11
LED/PG2: LED3.2(K) ; off-sheet LED/PG2
LED/PG3: LED4.2(K) ; off-sheet LED/PG3
LED/PG4: LED5.2(K) ; off-sheet LED/PG4
LED/PG5: LED6.2(K) ; off-sheet LED/PG5
LED/PG6: LED7.2(K) ; off-sheet LED/PG6
LED/PG7: LED8.2(K) ; off-sheet LED/PG7
LED/PG9: LED9.2(K) ; off-sheet LED/PG9
LED/PG10: LED10.2(K) ; off-sheet LED/PG10
LEVEL5V/PF0: U1.4(B) ; off-sheet LEVEL5V/PF0
LEVEL5V/PF1: U2.4(B) ; off-sheet LEVEL5V/PF1
LEVEL5V/PF2: U4.4(B) ; off-sheet LEVEL5V/PF2
LEVEL5V/PF3: U5.4(B) ; off-sheet LEVEL5V/PF3
OLED_CLK/PA5: OLED1.5 ; off-sheet OLED_CLK/PA5
OLED_DC/PA4: OLED1.4 ; off-sheet OLED_DC/PA4
OLED_MOSI/PA7: OLED1.6 ; off-sheet OLED_MOSI/PA7
OLED_RST/PA6: OLED1.3 ; off-sheet OLED_RST/PA6
PF14: JP6.1 ; off-sheet PF14
PF15: JP8.1 ; off-sheet PF15
SDIO_CLK(PC12): TF_Card1.5(CLK) ; off-sheet SDIO_CK/PC12  [also labelled SDIO_CK/PC12]
SDIO_CMD(PD2): R4.2 TF_Card1.3(CMD) ; off-sheet SDIO_CMD/PD2  [also labelled SDIO_CMD/PD2]
SDIO_D0(PC8): R5.2 TF_Card1.7(DATA0) ; off-sheet SDIO_D0/PC8  [also labelled SDIO_D0/PC8]
SDIO_D1(PC9): R6.2 TF_Card1.8(DATA1) ; off-sheet SDIO_D1/PC9  [also labelled SDIO_D1/PC9]
SDIO_D2(PC10): R2.2 TF_Card1.1(DATA2) ; off-sheet SDIO_D2/PC10  [also labelled SDIO_D2/PC10]
SDIO_D3(PC11): R3.2 TF_Card1.2(CD/DATA3) ; off-sheet SDIO_D3/PC11  [also labelled SDIO_D3/PC11]
SPI2_MISO/PB14: SPI1.5 ; off-sheet SPI2_MISO/PB14
SPI2_MOSI/PB15: SPI1.4 ; off-sheet SPI2_MOSI/PB15
SPI2_NSS/PB12: SPI1.6 ; off-sheet SPI2_NSS/PB12
SPI2_SCK/PB13: SPI1.3 ; off-sheet SPI2_SCK/PB13
SPI4_CLK/PE2: SPI2.4 ; off-sheet SPI4_CLK/PE2
SPI4_MISO/PE5: SPI2.2 ; off-sheet SPI4_MISO/PE5
SPI4_MOSI/PE6: SPI2.3 ; off-sheet SPI4_MOSI/PE6
SPI4_NSS/PE4: SPI2.1 ; off-sheet SPI4_NSS/PE4
SPI5_MISO/PF8: SPI3.5 ; off-sheet SPI5_MISO/PF8
SPI5_MOSI/PF9: SPI3.4 ; off-sheet SPI5_MOSI/PF9
SPI5_NSS/PF6: SPI3.6 ; off-sheet SPI5_NSS/PF6
SPI5_SCK/PF7: SPI3.3 ; off-sheet SPI5_SCK/PF7
SPI6_CLK/PG13: SPI4.3 ; off-sheet SPI6_CLK/PG13
SPI6_MISO/PG12: SPI4.5 ; off-sheet SPI6_MISO/PG12
SPI6_MOSI/PG14: SPI4.4 ; off-sheet SPI6_MOSI/PG14
SPI6_NSS/PG8: SPI4.6 ; off-sheet SPI6_NSS/PG8
TIM1_CH1/PE9: JP2.1 ; off-sheet TIM1_CH1/PE9
TIM1_CH2/PE11: JP3.1 ; off-sheet TIM1_CH2/PE11
TIM1_CH3/PE13: JP4.1 ; off-sheet TIM1_CH3/PE13
TIM1_CH4/PE14: JP5.1 ; off-sheet TIM1_CH4/PE14
TIM2_CH1/PA15: PWM_L1.1 ; off-sheet TIM2_CH1/PA15
TIM2_CH2/PB3: PWM_L1.4 ; off-sheet TIM2_CH2/PB3
TIM2_CH3/PA2: PWM_L1.10 ; off-sheet TIM2_CH3/PA2
TIM2_CH4/PA3: PWM_L1.7 ; off-sheet TIM2_CH4/PA3
TIM4_CH1/PD12: PWM_R1.3 ; off-sheet TIM4_CH1/PD12
TIM4_CH2/PD13: PWM_R1.6 ; off-sheet TIM4_CH2/PD13
TIM4_CH3/PD14: PWM_R1.9 ; off-sheet TIM4_CH3/PD14
TIM4_CH4/PD15: PWM_R1.12 ; off-sheet TIM4_CH4/PD15
TIM5_CH1/PH10: PWM_R1.15 ; off-sheet TIM5_CH1/PH10
TIM5_CH2/PH11: PWM_R1.18 ; off-sheet TIM5_CH2/PH11
TIM5_CH3/PH12: PWM_R1.21 ; off-sheet TIM5_CH3/PH12
TIM5_CH4/PI0: PWM_R1.24 ; off-sheet TIM5_CH4/PI0
TIM8_CH1/PI5: PWM_L1.13 ; off-sheet TIM8_CH1/PI5
TIM8_CH2/PI6: PWM_L1.16 ; off-sheet TIM8_CH2/PI6
TIM8_CH3/PI7: PWM_L1.19 ; off-sheet TIM8_CH3/PI7
TIM8_CH4/PI2: PWM_L1.22 ; off-sheet TIM8_CH4/PI2
TIM12_CH1/PH6: R12.1 ; off-sheet TIM12_CH1/PH6
TIM12_CH2/PH9: U3.4(B) ; off-sheet TIM12_CH2/PH9
UART4_RX/PA1: Q3.3(C) R10.1 ; off-sheet UART4_RX/PA1
UART7_RX/PE7: USART3.2 ; off-sheet UART7_RX/PE7
UART7_TX/PE8: USART3.1 ; off-sheet UART7_TX/PE8
UART8_RX/PE0: USART6.2 ; off-sheet UART8_RX/PE0
UART8_TX/PE1: USART6.1 ; off-sheet UART8_TX/PE1
USART1_RX/PA10: USART1.3 ; off-sheet USART1_RX/PA10
USART1_TX/PA9: USART1.4 ; off-sheet USART1_TX/PA9
USART2_RX/PD6: USART4.3 ; off-sheet USART2_RX/PD6
USART2_TX/PD5: USART4.4 ; off-sheet USART2_TX/PD5
USART3_RX/PD9: USART5.3 ; off-sheet USART3_RX/PD9
USART3_TX/PD8: USART5.4 ; off-sheet USART3_TX/PD8
USART6_RX/PC7: USART2.2 ; off-sheet USART6_RX/PC7
USART6_TX/PC6: USART2.1 ; off-sheet USART6_TX/PC6
USB_DM: R8.2 USB1.A7(D-) USB1.B7(D-)
USB_DP: R9.2 USB1.A6(D+) USB1.B6(D+)
USB_FS_DM/PA11: R8.1 ; off-sheet USB_FS_DM/PA11
USB_FS_DP/PA12: R9.1 ; off-sheet USB_FS_DP/PA12
VCC3V3_OLED: OLED1.1 ; off-sheet VCC3V3_OLED
VCC5V1A: C1.2 C3.2 C4.1 CAN2.4 CAN8.4 D1.2(K) IC1.3(VDD) IC_C1.2 IIC1.1 IIC2.4 IIC3.4 J1.3(VCC) J2.3(VCC) JP9.1 LASER1.1 LS1.1 SPI1.2 SPI2.5 SPI3.2 SPI4.2 U1.1(VCCA) U2.1(VCCA) U4.1(VCCA) U5.1(VCCA) USART1.1 USART2.4 USART3.4 USART4.1 USART5.1 USART6.4 USB1.A4(VBUS) USB1.A9(VBUS) USB1.B4(VBUS) USB1.B9(VBUS) ; off-sheet VCC5V1A
VCC5V4A: JP1.1 JP2.2 JP3.2 JP4.2 JP5.2 JP6.2 JP7.2 JP8.2 PWM_L1.2 PWM_L1.5 PWM_L1.8 PWM_L1.11 PWM_L1.14 PWM_L1.17 PWM_L1.20 PWM_L1.23 PWM_R1.2 PWM_R1.5 PWM_R1.8 PWM_R1.11 PWM_R1.14 PWM_R1.17 PWM_R1.20 PWM_R1.23 ; off-sheet VCC5V4A
WKUP/PA0: RST1.2 ; off-sheet WKUP/PA0
NetD1_1: D1.1(A) LS1.2 Q2.3(C)
NetDBUS1_3: DBUS1.3 R13.2
NetJP1_2: JP1.2 U1.3(A)
NetJP1_3: JP1.3 U2.3(A)
NetJP1_4: JP1.4 U4.3(A)
NetJP1_5: JP1.5 U5.3(A)
NetLASER1_2: LASER1.2 Q1.3(C)
NetLED1_1: LED1.1(A) R16.2
NetLED2_1: LED2.1(A) R17.2
NetLED3_1: LED3.1(A) R18.2
NetLED4_1: LED4.1(A) R19.2
NetLED5_1: LED5.1(A) R20.2
NetLED6_1: LED6.1(A) R21.2
NetLED7_1: LED7.1(A) R22.2
NetLED8_1: LED8.1(A) R23.2
NetLED9_1: LED9.1(A) R24.2
NetLED10_1: LED10.1(A) R25.2
NetQ1_1: Q1.1(B) R11.2 R14.2
NetQ2_1: Q2.1(B) R12.2 R15.2
NetQ3_1: Q3.1(B) R13.1

Not connected (* = marked no-connect by the designer): IC1 4(DOUT)*; J1 5(Vref)*; J2 5(Vref)*; LS1 3*; TF_Card1 9(K)*; USB1 1(SH1) 2(SH2) 3(SH3) 4(SH4) A2(TX1+) A3(TX1-) A5(CC1) A8(SBU1) A10(RX2-) A11(RX2+) B2(TX2+) B3(TX2-) B5(CC2) B8(SBU2) B10(RX1-) B11(RX1+)

### Notes on the sheet
- USB
- SD-CARD
- CANx2
- 蜂鸣器
- RBG_LED
- DBUS遥控器
- 激光
- 3.3V信号转5V-GPIO
- (near PWM_R1) PWM x 4 x 5
- LED x (8+2)
- UART x 6
- IIC x 3
- SPI x (1+4)
- GPIO x 2
- ADC x 1
- ADC x 8
- PR
- Title
- Size:
- Date:
- A3
- Number:
- Time:
- Revision:
- Sheet
- of
- File:
- (in symbol KLJ-5020) +

### Library data of the parts
C1-C4 IC_C1 = C: 贴片电容
CAN1 CAN3-CAN7 LASER1 = Header 2: 2P接插件
CAN2 CAN8 IIC1-IIC3 USART1-USART6 = Header 4: 4P接插件
D1 = 1N4148: 开关二极管
DBUS1 JP2-JP8 = Header 3: 3P接插件
J1 J2 = TJA1050: CAN芯片
JP1 SPI1-SPI4 = Header 6: 6P接插件
JP9 = Header 10: 10P接插件
LED1-LED10 = LED-SMD: 贴片LED
LS1 = KLJ-5020: 蜂鸣器
OLED1 = Header 7: 7P接插件
PWM_L1 = HDR3*8-left: Connector
PWM_R1 = HDR3*8-right: Connector
Q1 Q2 = 8050-SMD: 高频放大-NPN型
Q3 = PMBT3904: NPN Bipolar Transistor
R1-R25 = R: 贴片电阻
RST1 = KEY_M
TF_Card1 = TF_Card: TF卡座
U1-U5 = SN74LVC1T45DBVR: BOM_Manufacturer: TI; BOM_Paste Type: recommend; BOM_Assembly Type: smtWeld; BOM_Supplier: LCSC; BOM_Manufacturer Part: SN74LVC1T45DBVR; image: //image.lceda.cn/szlcsc/C7843.jpg; BOM_Supplier Part: C7843; spicePre: U; spiceSymbolName: SN74LVC1T45DBVR

## Nets that join several sheets
VDDA: STM32Core (42 pins), Peripheral (24 pins)
VSSA: STM32Core (70 pins), Peripheral (73 pins)
ADC1_IN8/PB0: STM32Core (U9.R5), Peripheral (JP9.2)
ADC1_IN9/PB1: STM32Core (U9.R4), Peripheral (JP9.3)
ADC1_IN10/PC0: STM32Core (U9.M2), Peripheral (JP9.4)
ADC1_IN11/PC1: STM32Core (U9.M3), Peripheral (JP9.5)
ADC1_IN12/PC2: STM32Core (U9.M4), Peripheral (JP9.6)
ADC1_IN13/PC3: STM32Core (U9.M5), Peripheral (JP9.7)
ADC1_IN14/PC4: STM32Core (U9.N5), Peripheral (JP9.8)
ADC1_IN15/PC5: STM32Core (U9.P5), Peripheral (JP9.9)
ADC3_IN14/PF4: STM32Core (U9.J3), Peripheral (OLED1.7)
ADC3_IN15/PF5: STM32Core (U9.K3), Peripheral (JP7.1)
CAN1_RX/PD0: STM32Core (U9.B12), Peripheral (J1.4)
CAN1_TX/PD1: STM32Core (U9.C12), Peripheral (J1.1)
CAN2_RX/PB5: STM32Core (U9.A6), Peripheral (J2.4)
CAN2_TX/PB6: STM32Core (U9.B6), Peripheral (J2.1)
I2C1_SCL/PB8: STM32Core (U9.A5), Peripheral (IIC1.4)
I2C1_SDA/PB9: STM32Core (U9.B4), Peripheral (IIC1.3)
I2C2_SCL/PH4: STM32Core (U9.H4), Peripheral (IIC2.1)
I2C2_SDA/PH5: STM32Core (U9.J4), Peripheral (IIC2.2)
I2C3_SCL/PH7: STM32Core (U9.N12), Peripheral (IIC3.1)
I2C3_SDA/PH8: STM32Core (U9.M12), Peripheral (IIC3.2)
LASER(PF13): STM32Core (U9.N6), Peripheral (R11.1)
LED/PD10: STM32Core (U9.N15), Peripheral (LED2.2)
LED/PD11: STM32Core (U9.N14), Peripheral (LED1.2)
LED/PG2: STM32Core (U9.L15), Peripheral (LED3.2)
LED/PG3: STM32Core (U9.K15), Peripheral (LED4.2)
LED/PG4: STM32Core (U9.K14), Peripheral (LED5.2)
LED/PG5: STM32Core (U9.K13), Peripheral (LED6.2)
LED/PG6: STM32Core (U9.J15), Peripheral (LED7.2)
LED/PG7: STM32Core (U9.J14), Peripheral (LED8.2)
LED/PG9: STM32Core (U9.C10), Peripheral (LED9.2)
LED/PG10: STM32Core (U9.B10), Peripheral (LED10.2)
LEVEL5V/PF0: STM32Core (U9.E2), Peripheral (U1.4)
LEVEL5V/PF1: STM32Core (U9.H3), Peripheral (U2.4)
LEVEL5V/PF2: STM32Core (U9.H2), Peripheral (U4.4)
LEVEL5V/PF3: STM32Core (U9.J2), Peripheral (U5.4)
OLED_CLK/PA5: STM32Core (U9.P4), Peripheral (OLED1.5)
OLED_DC/PA4: STM32Core (U9.N4), Peripheral (OLED1.4)
OLED_MOSI/PA7: STM32Core (U9.R3), Peripheral (OLED1.6)
OLED_RST/PA6: STM32Core (U9.P3), Peripheral (OLED1.3)
PF14: STM32Core (U9.R7), Peripheral (JP6.1)
PF15: STM32Core (U9.P7), Peripheral (JP8.1)
SDIO_CLK(PC12): STM32Core (U9.A12), Peripheral (TF_Card1.5)
SDIO_CMD(PD2): STM32Core (U9.D12), Peripheral (R4.2 TF_Card1.3)
SDIO_D0(PC8): STM32Core (U9.G14), Peripheral (R5.2 TF_Card1.7)
SDIO_D1(PC9): STM32Core (U9.F14), Peripheral (R6.2 TF_Card1.8)
SDIO_D2(PC10): STM32Core (U9.B14), Peripheral (R2.2 TF_Card1.1)
SDIO_D3(PC11): STM32Core (U9.B13), Peripheral (R3.2 TF_Card1.2)
SPI2_MISO/PB14: STM32Core (U9.R14), Peripheral (SPI1.5)
SPI2_MOSI/PB15: STM32Core (U9.R15), Peripheral (SPI1.4)
SPI2_NSS/PB12: STM32Core (U9.P12), Peripheral (SPI1.6)
SPI2_SCK/PB13: STM32Core (U9.P13), Peripheral (SPI1.3)
SPI4_CLK/PE2: STM32Core (U9.A2), Peripheral (SPI2.4)
SPI4_MISO/PE5: STM32Core (U9.B2), Peripheral (SPI2.2)
SPI4_MOSI/PE6: STM32Core (U9.B3), Peripheral (SPI2.3)
SPI4_NSS/PE4: STM32Core (U9.B1), Peripheral (SPI2.1)
SPI5_MISO/PF8: STM32Core (U9.L3), Peripheral (SPI3.5)
SPI5_MOSI/PF9: STM32Core (U9.L2), Peripheral (SPI3.4)
SPI5_NSS/PF6: STM32Core (U9.K2), Peripheral (SPI3.6)
SPI5_SCK/PF7: STM32Core (U9.K1), Peripheral (SPI3.3)
SPI6_CLK/PG13: STM32Core (U9.A8), Peripheral (SPI4.3)
SPI6_MISO/PG12: STM32Core (U9.B8), Peripheral (SPI4.5)
SPI6_MOSI/PG14: STM32Core (U9.A7), Peripheral (SPI4.4)
SPI6_NSS/PG8: STM32Core (U9.H14), Peripheral (SPI4.6)
TIM1_CH1/PE9: STM32Core (U9.P9), Peripheral (JP2.1)
TIM1_CH2/PE11: STM32Core (U9.P10), Peripheral (JP3.1)
TIM1_CH3/PE13: STM32Core (U9.N11), Peripheral (JP4.1)
TIM1_CH4/PE14: STM32Core (U9.P11), Peripheral (JP5.1)
TIM2_CH1/PA15: STM32Core (U9.A13), Peripheral (PWM_L1.1)
TIM2_CH2/PB3: STM32Core (U9.A10), Peripheral (PWM_L1.4)
TIM2_CH3/PA2: STM32Core (U9.P2), Peripheral (PWM_L1.10)
TIM2_CH4/PA3: STM32Core (U9.R2), Peripheral (PWM_L1.7)
TIM4_CH1/PD12: STM32Core (U9.N13), Peripheral (PWM_R1.3)
TIM4_CH2/PD13: STM32Core (U9.M15), Peripheral (PWM_R1.6)
TIM4_CH3/PD14: STM32Core (U9.M14), Peripheral (PWM_R1.9)
TIM4_CH4/PD15: STM32Core (U9.L14), Peripheral (PWM_R1.12)
TIM5_CH1/PH10: STM32Core (U9.L13), Peripheral (PWM_R1.15)
TIM5_CH2/PH11: STM32Core (U9.L12), Peripheral (PWM_R1.18)
TIM5_CH3/PH12: STM32Core (U9.K12), Peripheral (PWM_R1.21)
TIM5_CH4/PI0: STM32Core (U9.E14), Peripheral (PWM_R1.24)
TIM8_CH1/PI5: STM32Core (U9.C4), Peripheral (PWM_L1.13)
TIM8_CH2/PI6: STM32Core (U9.C3), Peripheral (PWM_L1.16)
TIM8_CH3/PI7: STM32Core (U9.C2), Peripheral (PWM_L1.19)
TIM8_CH4/PI2: STM32Core (U9.C14), Peripheral (PWM_L1.22)
TIM12_CH1/PH6: STM32Core (U9.M11), Peripheral (R12.1)
TIM12_CH2/PH9: STM32Core (U9.M13), Peripheral (U3.4)
UART4_RX/PA1: STM32Core (U9.N2), Peripheral (Q3.3 R10.1)
UART7_RX/PE7: STM32Core (U9.R8), Peripheral (USART3.2)
UART7_TX/PE8: STM32Core (U9.P8), Peripheral (USART3.1)
UART8_RX/PE0: STM32Core (U9.A4), Peripheral (USART6.2)
UART8_TX/PE1: STM32Core (U9.A3), Peripheral (USART6.1)
USART1_RX/PA10: STM32Core (U9.D15), Peripheral (USART1.3)
USART1_TX/PA9: STM32Core (U9.E15), Peripheral (USART1.4)
USART2_RX/PD6: STM32Core (U9.B11), Peripheral (USART4.3)
USART2_TX/PD5: STM32Core (U9.C11), Peripheral (USART4.4)
USART3_RX/PD9: STM32Core (U9.P14), Peripheral (USART5.3)
USART3_TX/PD8: STM32Core (U9.P15), Peripheral (USART5.4)
USART6_RX/PC7: STM32Core (U9.G15), Peripheral (USART2.2)
USART6_TX/PC6: STM32Core (U9.H15), Peripheral (USART2.1)
USB_FS_DM/PA11: STM32Core (U9.C15), Peripheral (R8.1)
USB_FS_DP/PA12: STM32Core (U9.B15), Peripheral (R9.1)
WKUP/PA0: STM32Core (U9.N3), Peripheral (RST1.2)